# Altium schematic sheet RS485.SchDoc
size A4
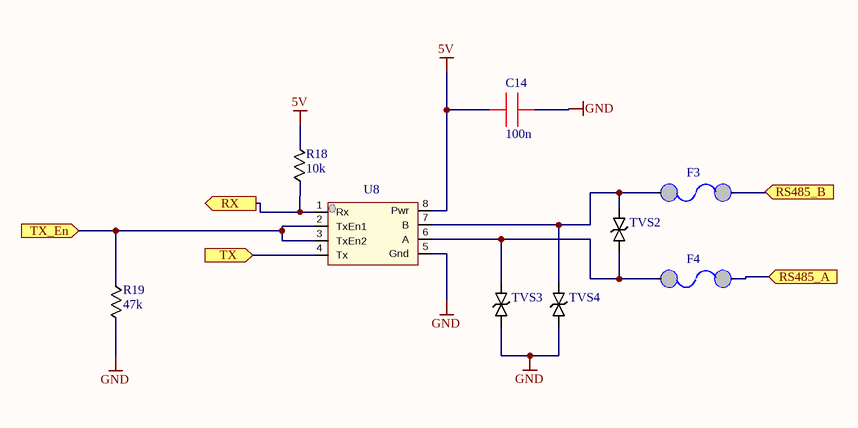
[diagram p0: RS485.SchDoc]

## Parts
C14  100n  [0603]
F3  Resettable FUSE  [1210]  (value not drawn)
F4  Resettable FUSE  [1210]  (value not drawn)
R18  10k  [0603]
R19  47k  [0603]
TVS2  TVS 6V  [DO-214AC]  (value not drawn)
TVS3  TVS 6V  [DO-214AC]  (value not drawn)
TVS4  TVS 6V  [DO-214AC]  (value not drawn)
U8  RS485 Driver  [SOIC 8]  (value not drawn)

## Ports
RS485_A, RS485_B, RX, TX, TX_En

## Nets
5V: C14.1 R18.2 U8.8(Pwr)
GND: C14.2 R19.2 TVS3.1 TVS4.1 U8.5(Gnd)
RS485_A: F4.1 ; port RS485_A
RS485_B: F3.1 ; port RS485_B
RX: R18.1 U8.1(Rx) ; port RX
TX: U8.4(Tx) ; port TX
TX_En: R19.1 U8.2(TxEn1) U8.3(TxEn2) ; port TX_En
NetF3_2: F3.2 TVS2.2 TVS4.2 U8.7(B)
NetF4_2: F4.2 TVS2.1 TVS3.2 U8.6(A)

## Library data of the parts
C14 = 0603 CAP: CC0603KRX7R9BB104
F3 F4 = Fuse PTS: MF-USMF005-2
R18 = 0603 RES: RC0603FR-0710KL
R19 = 0603 RES: RC0603FR-0747KL
TVS2-TVS4 = TVS: SMAJ6.0CA
U8 = MAX485: SN65HVD3082EDR